# EasyEDA schematic schematic.json
TITLE: Sheet_1; REV: 1.0; Date: 2024-01-16; Sheet: 1/1; Drawn By: ANSHUMANDOCX; Company: Your Company
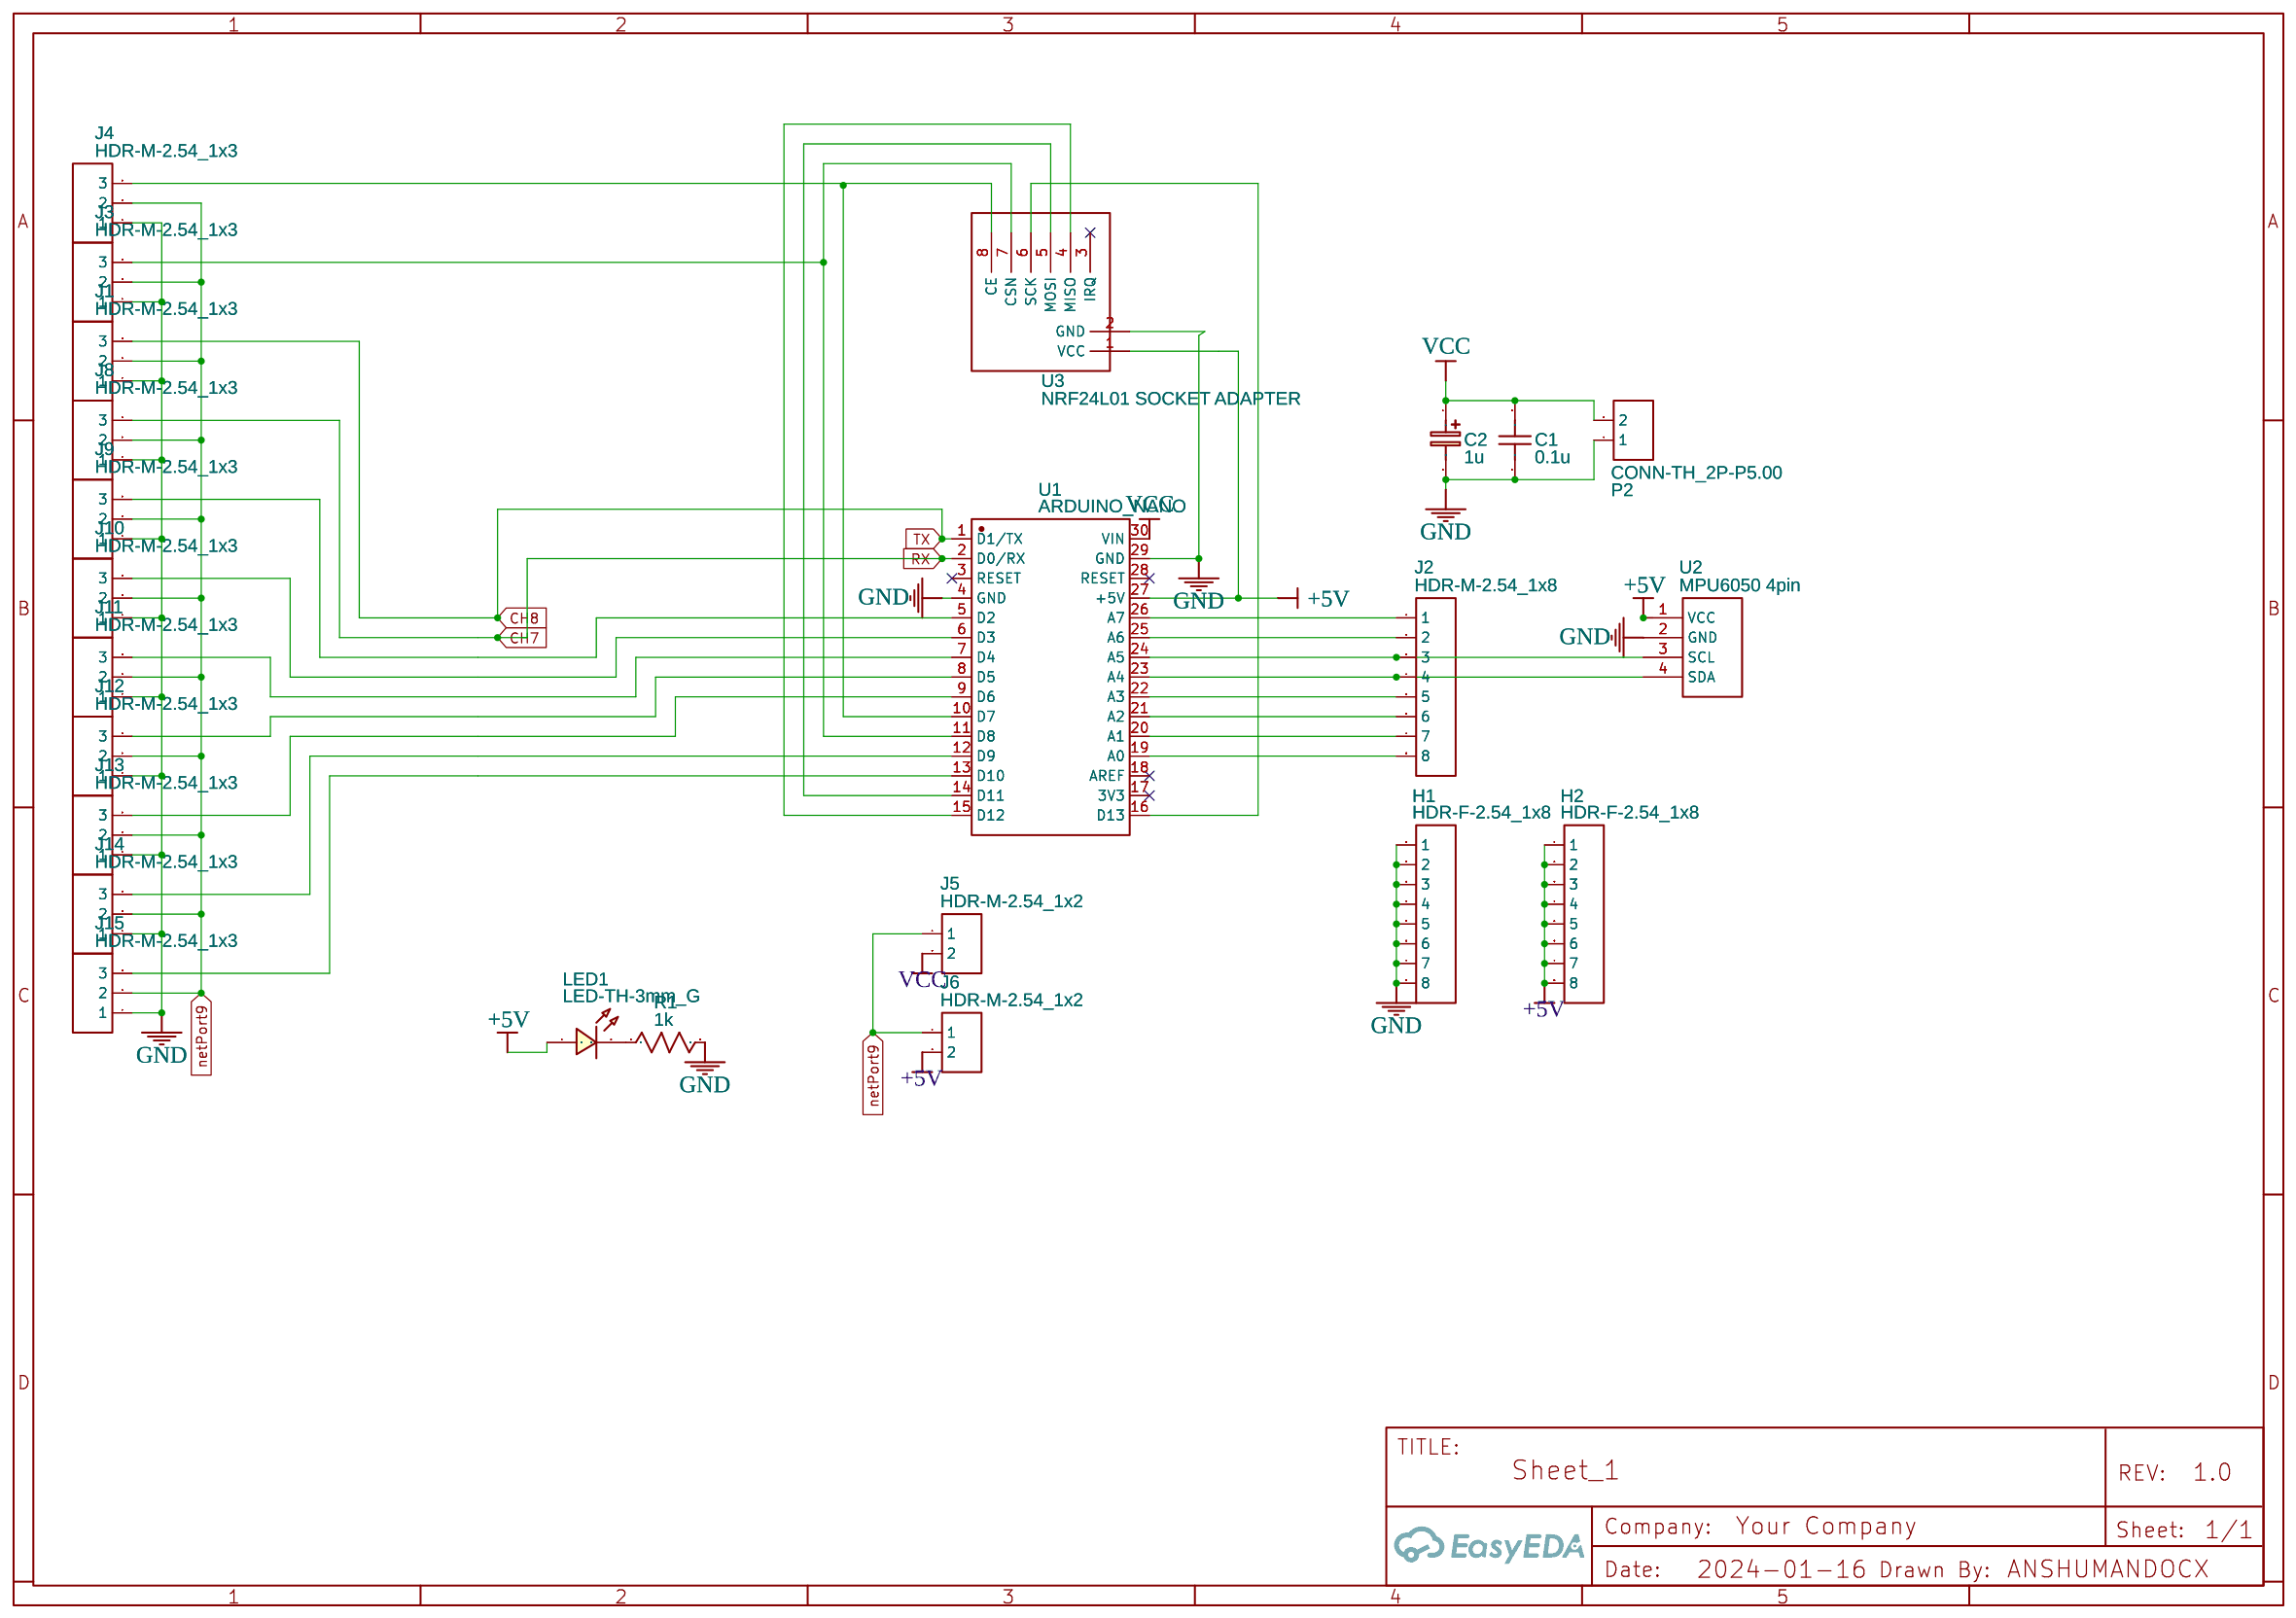
[diagram p0: schematic sheet]

## Parts
C1  0.1u  [C0805]
C2  1u  [CAP-D5.0×F2.0]
H1  HDR-F-2.54_1x8  [HDR-F-2.54_1X8]
H2  HDR-F-2.54_1x8  [HDR-F-2.54_1X8]
J1  HDR-M-2.54_1x3  [HDR-M-2.54_1X3]
J2  HDR-M-2.54_1x8  [HDR-M-2.54_1X8]
J3  HDR-M-2.54_1x3  [HDR-M-2.54_1X3]
J4  HDR-M-2.54_1x3  [HDR-M-2.54_1X3]
J5  HDR-M-2.54_1x2  [HDR-M-2.54_1X2]
J6  HDR-M-2.54_1x2  [HDR-M-2.54_1X2]
J8  HDR-M-2.54_1x3  [HDR-M-2.54_1X3]
J9  HDR-M-2.54_1x3  [HDR-M-2.54_1X3]
J10  HDR-M-2.54_1x3  [HDR-M-2.54_1X3]
J11  HDR-M-2.54_1x3  [HDR-M-2.54_1X3]
J12  HDR-M-2.54_1x3  [HDR-M-2.54_1X3]
J13  HDR-M-2.54_1x3  [HDR-M-2.54_1X3]
J14  HDR-M-2.54_1x3  [HDR-M-2.54_1X3]
J15  HDR-M-2.54_1x3  [HDR-M-2.54_1X3]
LED1  LED-TH-3mm_G  [LED-TH_BD3.0_GREEN]
P2  CONN-TH_2P-P5.00  [CONN-TH_2P-P5.00]
R1  1k  [R_AXIAL-0.4]
U1  ARDUINO_NANO  [COMM-TH_ARDUINO_NANO]
U2  MPU6050 4pin  [MPU6050 4PIN]
U3  NRF24L01 SOCKET ADAPTER  [NRF24L01 SOCKET ADAPTER]

## Library data of the parts
C1 = C_0805_US: Contributor: LCEDA_Lib
C2 = CE_TH_D5.0×F2.0_EU: Contributor: LCEDA_Lib
H1 H2 = HDR-F-2.54_1x8: Supplier Part: C225505; Supplier: LCSC; Contributor: LCEDA_Lib
J1 J3 J4 J8-J15 = HDR-M-2.54_1x3: Supplier Part: C180248; Supplier: LCSC; Contributor: LCEDA_Lib
J2 = HDR-M-2.54_1x8: Supplier Part: C190820; Supplier: LCSC; Contributor: LCEDA_Lib
J5 J6 = HDR-M-2.54_1x2: Supplier Part: C124375; Supplier: LCSC; Contributor: LCEDA_Lib
LED1 = LED-TH-3mm_G: Manufacturer: EVERLIGHT(台湾亿光); Manufacturer Part: 204-10SYGD/S530-E3; Supplier Part: C85161; Contributor: LCEDA_Lib
P2 = CONN-TH_2P-P5.00: Supplier: LCSC; Contributor: LCEDA_Lib
R1 = R_AXIAL-0.4_US: Contributor: LCEDA_Lib
U1 = ARDUINO_NANO: Contributor: lcsc; Supplier: LCSC; Supplier Part: C9900017879; Manufacturer: null; JLCPCB Part Class: Extended Part; link: https://lcsc.com/eda_search?q=C9900017879&%26type=1&ref=editor
U2 = MPU6050 4pin: Contributor: anshumandocx
U3 = NRF24L01 SOCKET ADAPTER: Contributor: adicahyono

## Nets
+5V: H2.1 H2.2 H2.3 H2.4 H2.5 H2.6 H2.7 H2.8 J6.2 LED1.1 U1.27(+5V) U2.1(VCC) U3.1(VCC)
GND: C1.1 C2.2 H1.1 H1.2 H1.3 H1.4 H1.5 H1.6 H1.7 H1.8 J1.1 J3.1 J4.1 J8.1 J9.1 J10.1 J11.1 J12.1 J13.1 J14.1 J15.1 P2.1 R1.2 U1.4(GND) U1.29(GND) U2.2(GND) U3.2(GND)
VCC: C1.2 C2.1 J5.2 P2.2 U1.30(VIN)
CH7: J8.3 U1.2(D0/RX)
CH8: J1.3 U1.1(D1/TX)
netPort9: J1.2 J3.2 J4.2 J5.1 J6.1 J8.2 J9.2 J10.2 J11.2 J12.2 J13.2 J14.2 J15.2
Net-(J2-1): J2.1 U1.26(A7)
Net-(J2-2): J2.2 U1.25(A6)
Net-(J2-3): J2.3 U1.24(A5) U2.3(SCL)
Net-(J2-4): J2.4 U1.23(A4) U2.4(SDA)
Net-(J2-5): J2.5 U1.22(A3)
Net-(J2-6): J2.6 U1.21(A2)
Net-(J2-7): J2.7 U1.20(A1)
Net-(J2-8): J2.8 U1.19(A0)
Net-(J3-3): J3.3 U1.11(D8) U3.7(CSN)
Net-(J4-3): J4.3 U1.10(D7) U3.8(CE)
Net-(J9-3): J9.3 U1.5(D2)
Net-(J10-3): J10.3 U1.6(D3)
Net-(J11-3): J11.3 U1.7(D4)
Net-(J12-3): J12.3 U1.8(D5)
Net-(J13-3): J13.3 U1.9(D6)
Net-(J14-3): J14.3 U1.12(D9)
Net-(J15-3): J15.3 U1.13(D10)
Net-(LED1-2): LED1.2 R1.1
Net-(U1-14): U1.14(D11) U3.5(MOSI)
Net-(U1-15): U1.15(D12) U3.4(MISO)
Net-(U1-16): U1.16(D13) U3.6(SCK)

Not connected (* = marked no-connect by the designer): U1 3(RESET)* 17(3V3)* 18(AREF)* 28(RESET)*; U3 3(IRQ)*
